# EAGLE design M627 (EAGLE 6.6.0)
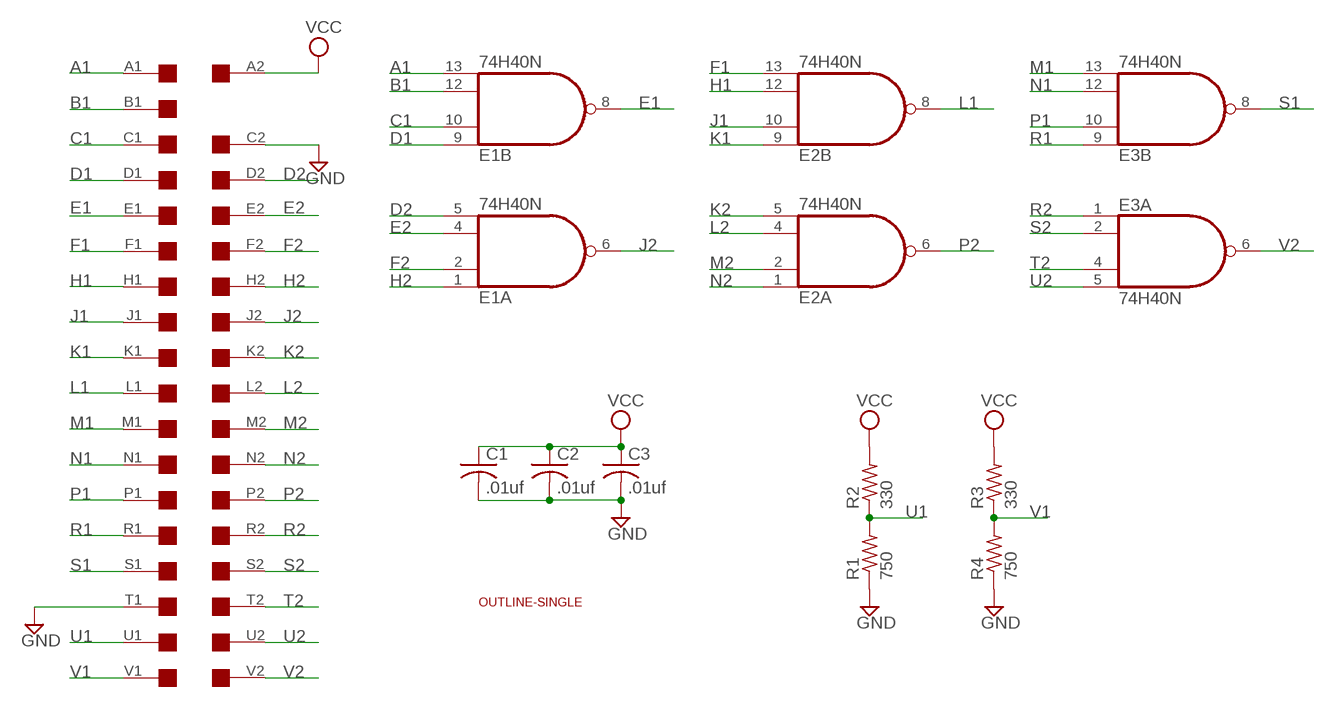
[diagram p0: schematic, sheet 1]

## Parts
C1  .01uf  C-US050-025X075  [C050-025X075]
C2  .01uf  C-US050-025X075  [C050-025X075]
C3  .01uf  C-US050-025X075  [C050-025X075]
E1  74H40N  74S20N  [DIL14]
E2  74H40N  74S20N  [DIL14]
E3  74H40N  74S20N  [DIL14]
R1  750  R-US_0207/10  [0207/10]
R2  330  R-US_0207/10  [0207/10]
R3  330  R-US_0207/10  [0207/10]
R4  750  R-US_0207/10  [0207/10]
U$1  OUTLINE-SINGLE  [SINGLE]
U$2  SINGLE  [EDGE-CON2]

## Nets
A1: E1.13(B:I3) U$2.A1
B1: E1.12(B:I2) U$2.B1
C1: E1.10(B:I1) U$2.C1
D1: E1.9(B:I0) U$2.D1
D2: E1.5(A:I3) U$2.D2
E1: E1.8(B:O) U$2.E1
E2: E1.4(A:I2) U$2.E2
F1: E2.13(B:I3) U$2.F1
F2: E1.2(A:I1) U$2.F2
GND: C1.2 C2.2 C3.2 R1.1 R4.1 U$2.C2 U$2.T1
H1: E2.12(B:I2) U$2.H1
H2: E1.1(A:I0) U$2.H2
J1: E2.10(B:I1) U$2.J1
J2: E1.6(A:O) U$2.J2
K1: E2.9(B:I0) U$2.K1
K2: E2.5(A:I3) U$2.K2
L1: E2.8(B:O) U$2.L1
L2: E2.4(A:I2) U$2.L2
M1: E3.13(B:I3) U$2.M1
M2: E2.2(A:I1) U$2.M2
N1: E3.12(B:I2) U$2.N1
N2: E2.1(A:I0) U$2.N2
P1: E3.10(B:I1) U$2.P1
P2: E2.6(A:O) U$2.P2
R1: E3.9(B:I0) U$2.R1
R2: E3.1(A:I0) U$2.R2
S1: E3.8(B:O) U$2.S1
S2: E3.2(A:I1) U$2.S2
T2: E3.4(A:I2) U$2.T2
U1: R1.2 R2.1 U$2.U1
U2: E3.5(A:I3) U$2.U2
V1: R3.1 R4.2 U$2.V1
V2: E3.6(A:O) U$2.V2
VCC: C1.1 C2.1 C3.1 R2.2 R3.2 U$2.A2
Unconnected: U$2.B2

## Power pins joined to a net without a drawn wire
GND: E1.7(P:GND) E2.7(P:GND) E3.7(P:GND)
VCC: E1.14(P:VCC) E2.14(P:VCC) E3.14(P:VCC)

## Library data of the parts
C1-C3 = rcl:C-US: CAPACITOR, American symbol
E1-E3 = 74xx-us:74*20: Dual 4-input NAND gate
R1-R4 = rcl:R-US_: RESISTOR, American symbol
U$1 = dec-con:OUTLINE-*: Board outlines for DEC boards.
U$2 = dec-con:SINGLE: Single-Height DEC board

## Board
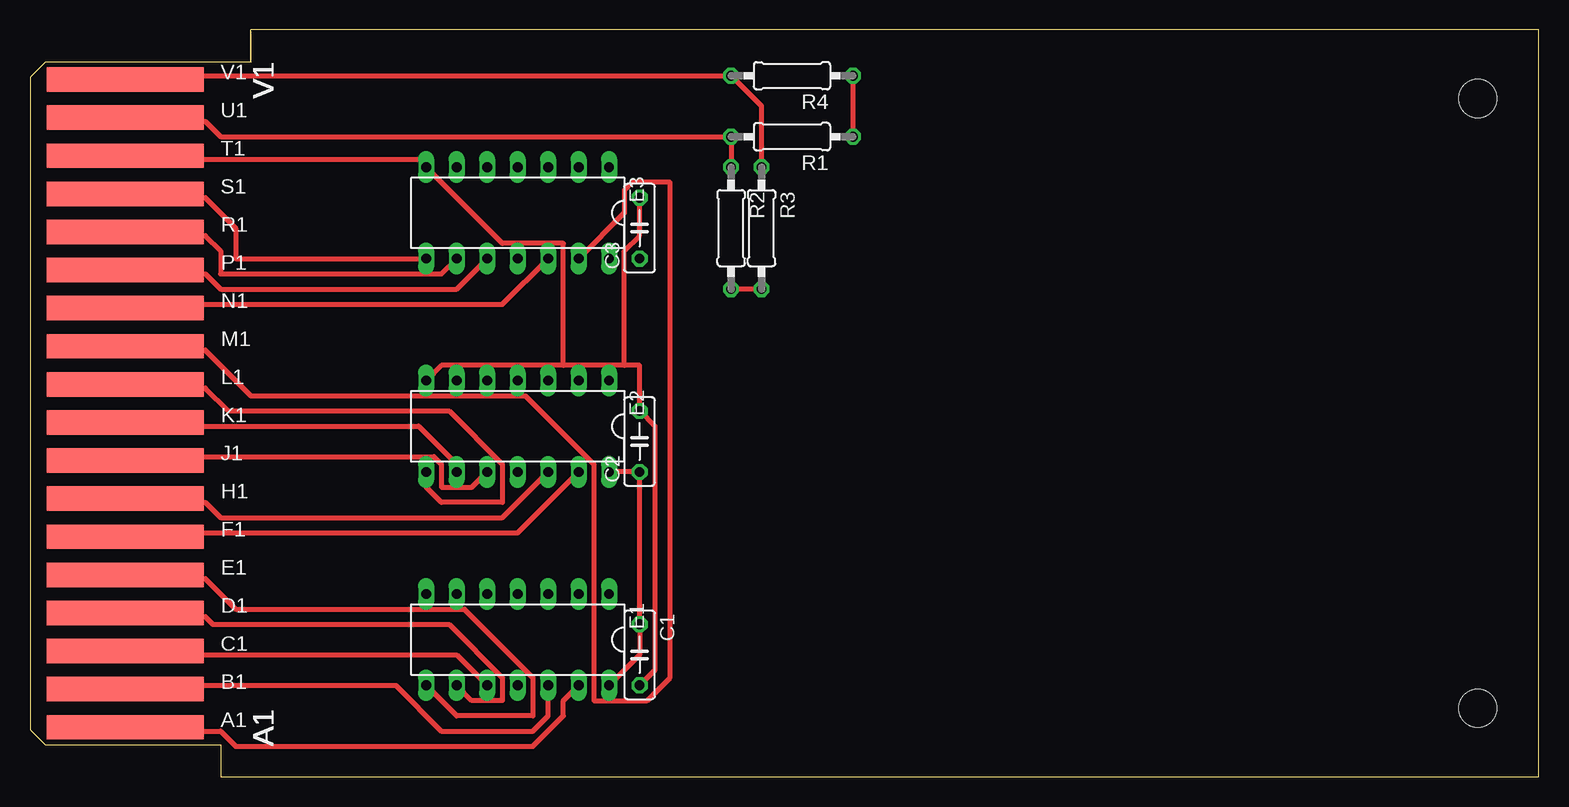
[diagram p1: board, top side]
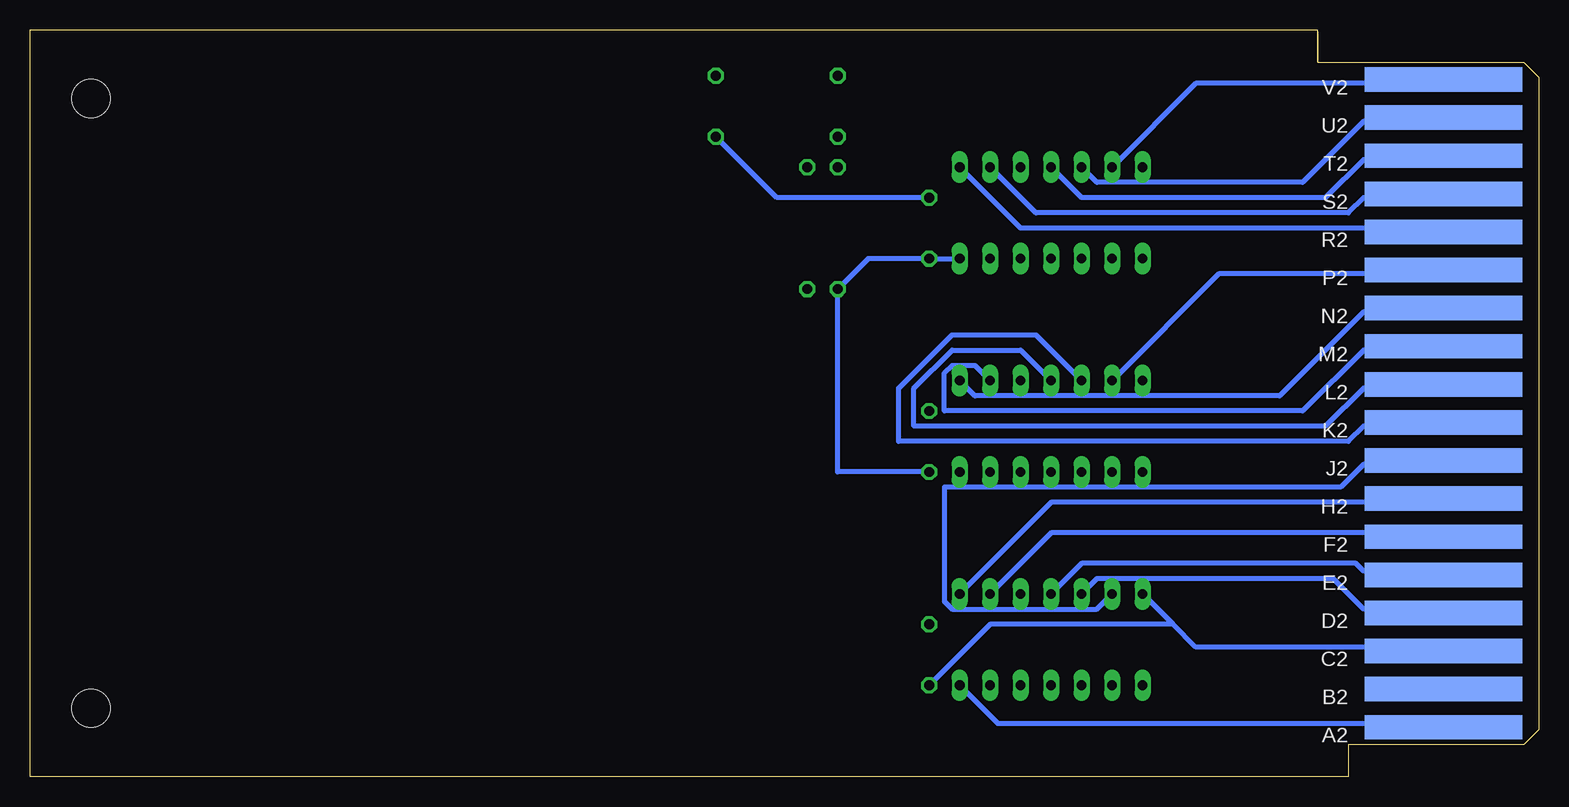
[diagram p2: board, bottom side, seen from below]

Size 125.73 x 62.23 mm. Coordinates in mm from the lower left corner, seen from the top.
Copper layers (1+16): Top 0.035mm / dielectric 1.5mm / Bottom 0.035mm
Design rules "16mils": minimum track width 16mil, minimum drill 32mil, track to track 15mil, track to pad 10mil, pad to pad 10mil, via to via 10mil, smd to smd 10mil, copper to edge 13mil, drill to drill 10mil, minimum pad ring 10mil, minimum via ring 8mil, stop-mask expansion 0mil, vias tented up to drill 0mil, thermal gap 10mil

### Footprints (pad centres in the part's own frame; a part is rotated, then mirrored left to right if it is on the bottom)
C050-025X075 = drill 0.813 octagon: 1 -2.54,0; 2 2.54,0
DIL14 = drill 0.813 long: 1 -7.62,-3.81; 2 -5.08,-3.81; 3 -2.54,-3.81; 4 0,-3.81; 5 2.54,-3.81; 6 5.08,-3.81; 7 7.62,-3.81; 8 7.62,3.81; 9 5.08,3.81; 10 2.54,3.81; 11 0,3.81; 12 -2.54,3.81; 13 -5.08,3.81; 14 -7.62,3.81
0207/10 = drill 0.813 octagon: 1 -5.08,0; 2 5.08,0
SINGLE = hole 3.175: 120.65,56.515; 120.65,5.715
EDGE-CON2 = smd 13.106 x 2.032: A1 7.938,4.128; B1 7.938,7.303; C1 7.938,10.477; D1 7.938,13.652; E1 7.938,16.828; F1 7.938,20.003; H1 7.938,23.177; J1 7.938,26.352; K1 7.938,29.527; L1 7.938,32.703; M1 7.938,35.877; N1 7.938,39.053; P1 7.938,42.227; R1 7.938,45.403; S1 7.938,48.578; T1 7.938,51.752; U1 7.938,54.928; V1 7.938,58.102 | smd 13.106 x 2.032 bottom: A2 7.938,4.128; B2 7.938,7.303; C2 7.938,10.477; D2 7.938,13.652; E2 7.938,16.828; F2 7.938,20.003; H2 7.938,23.177; J2 7.938,26.352; K2 7.938,29.527; L2 7.938,32.703; M2 7.938,35.877; N2 7.938,39.053; P2 7.938,42.227; R2 7.938,45.403; S2 7.938,48.578; T2 7.938,51.752; U2 7.938,54.928; V2 7.938,58.102

### Placement (x,y rotation side)
C1  50.8,10.16 270 top
C2  50.8,27.94 90 top
C3  50.8,45.72 90 top
E1  40.64,11.43 180 top
E2  40.64,29.21 180 top
E3  40.64,46.99 180 top
R1  63.5,53.34 180 top
R2  58.42,45.72 270 top
R3  60.96,45.72 270 top
R4  63.5,58.42 180 top
U$1  0,0 0 top
U$2  0,0 0 top

### Tracks (layer width: path | path; a pad name or v marks a point on that pad's centre or on a via)
A1
  Top 0.406: E1.13 44.45,6.35 44.45,5.08 41.91,2.54 17.15,2.54 15.88,3.81 8.26,3.81 U$2.A1
B1
  Top 0.406: E1.12 43.18,5.08 41.91,3.81 34.29,3.81 30.48,7.62 12.7,7.62 8.26,6.99 U$2.B1
C1
  Top 0.406: E1.10 35.56,10.16 8.26,10.16 U$2.C1
D1
  Top 0.406: E1.9 36.83,6.35 39.37,6.35 39.37,8.26 34.93,12.7 15.24,12.7 14.61,13.34 8.26,13.34 U$2.D1
D2
  Bottom 0.406: E1.5 36.83,16.51 17.15,16.51 14.61,13.97 8.26,13.97 U$2.D2
E1
  Top 0.406: E1.8 35.56,5.08 41.91,5.08 41.91,8.26 36.2,13.97 17.15,13.97 14.61,16.51 8.26,16.51 U$2.E1
E2
  Bottom 0.406: E1.4 38.1,17.78 15.24,17.78 14.61,17.14 8.26,17.14 U$2.E2
F1
  Top 0.406: E2.13 40.64,20.32 8.26,20.32 U$2.F1
F2
  Bottom 0.406: E1.2 40.64,20.32 8.26,20.32 U$2.F2
GND
  Top 0.406: R4.1 R1.1 | E2.7 34.29,34.29 44.45,34.29 | 49.53,34.29 50.8,34.29 C2.2 52.07,29.21 52.07,8.89 C1.2 | 49.53,34.29 44.45,34.29 | C3.2 50.8,45.09 49.53,43.81 49.53,34.29 | 44.45,34.29 44.45,44.45 39.37,44.45 E3.7 33.02,51.44 8.26,51.44 U$2.T1
  Bottom 0.406: 30.48,12.7 28.58,10.79 8.26,10.79 U$2.C2 | 30.48,12.7 E1.7 | C1.2 45.72,12.7 30.48,12.7 | R1.1 63.5,48.26 C3.2
H1
  Top 0.406: E2.12 39.37,21.59 15.88,21.59 14.61,22.86 8.26,22.86 U$2.H1
H2
  Bottom 0.406: E1.1 40.64,22.86 8.26,22.86 U$2.H2
J1
  Top 0.406: E2.10 36.83,24.13 34.29,24.13 34.29,26.04 33.66,26.67 8.26,26.67 U$2.J1
J2
  Bottom 0.406: E1.6 36.83,13.97 48.9,13.97 49.53,14.61 49.53,24.13 16.51,24.13 14.61,26.04 8.26,26.04 U$2.J2
K1
  Top 0.406: E2.9 35.56,26.04 32.39,29.21 8.26,29.21 U$2.K1
K2
  Bottom 0.406: E2.5 41.91,36.83 48.9,36.83 53.34,32.38 53.34,27.94 15.88,27.94 14.61,29.21 8.26,29.21 U$2.K2
L1
  Top 0.406: E2.8 33.02,24.13 34.29,22.86 39.37,22.86 39.37,26.04 34.93,30.48 16.51,30.48 14.61,32.38 8.26,32.38 U$2.L1
L2
  Bottom 0.406: E2.4 43.18,35.56 48.9,35.56 52.07,32.38 52.07,29.21 17.78,29.21 14.61,32.38 8.26,32.38 U$2.L2
M1
  Top 0.406: E3.13 49.53,46.99 49.53,48.9 50.17,49.53 53.34,49.53 53.34,8.26 51.44,6.35 46.99,6.35 46.99,26.04 41.28,31.75 18.42,31.75 14.61,35.56 8.26,35.56 U$2.M1
M2
  Bottom 0.406: E2.2 46.99,34.29 48.9,34.29 49.53,33.66 49.53,30.48 19.69,30.48 14.61,35.56 8.26,35.56 U$2.M2
N1
  Top 0.406: E3.12 39.37,39.37 8.26,39.37 U$2.N1
N2
  Bottom 0.406: E2.1 46.99,31.75 21.59,31.75 14.61,38.73 8.26,38.73 U$2.N2
P1
  Top 0.406: E3.10 35.56,40.64 15.88,40.64 14.61,41.91 8.26,41.91 U$2.P1
P2
  Bottom 0.406: E2.6 26.67,41.91 8.26,41.91 U$2.P2
R1
  Top 0.406: E3.9 34.29,41.91 15.88,41.91 15.88,43.81 14.61,45.09 8.26,45.09 U$2.R1
R2
  Bottom 0.406: E3.1 43.18,45.72 8.26,45.72 U$2.R2
S1
  Top 0.406: E3.8 17.15,43.18 17.15,45.72 14.61,48.26 8.26,48.26 U$2.S1
S2
  Bottom 0.406: E3.2 41.91,46.99 15.88,46.99 14.61,48.26 8.26,48.26 U$2.S2
T2
  Bottom 0.406: E3.4 38.1,48.26 17.78,48.26 14.61,51.44 8.26,51.44 U$2.T2
U1
  Top 0.406: U$2.U1 8.26,54.61 14.61,54.61 15.88,53.34 R1.2 R2.1
U2
  Bottom 0.406: E3.5 36.83,49.53 19.69,49.53 14.61,54.61 8.26,54.61 U$2.U2
V1
  Top 0.406: R3.1 60.96,55.88 R4.2 8.26,58.42 U$2.V1
V2
  Bottom 0.406: E3.6 28.58,57.78 8.26,57.78 U$2.V2
VCC
  Top 0.406: R3.2 R2.2 | E2.14 C2.1 C1.1 50.8,10.16 E1.14
  Bottom 0.406: E3.14 C3.1 55.88,43.18 R2.2 58.42,25.4 C2.1 | E1.14 45.09,4.45 8.26,4.45 U$2.A2

### Text on the board
tNames: V1 | V1 | V1 | V1 | V1 | V1 | V1 | V1 | V1 | V1 | V1 | V1 | V1 | V1 | V1 | V1 | V1 | V1 | V1 | V1 | V1 | V1 | V1 | V1 | V1 | V1 | V1 | V1 | V1 | V1 | V1 | V1 | A1 | A1 | A1 | A1 | A1 | A1 | A1 | A1 | A1 | A1 | A1 | A1 | A1 | A1 | A1 | A1 | A1 | A1 | A1 | A1 | A1 | A1 | A1 | A1 | A1 | A1 | A1 | A1 | A1 | A1 | A1 | A1